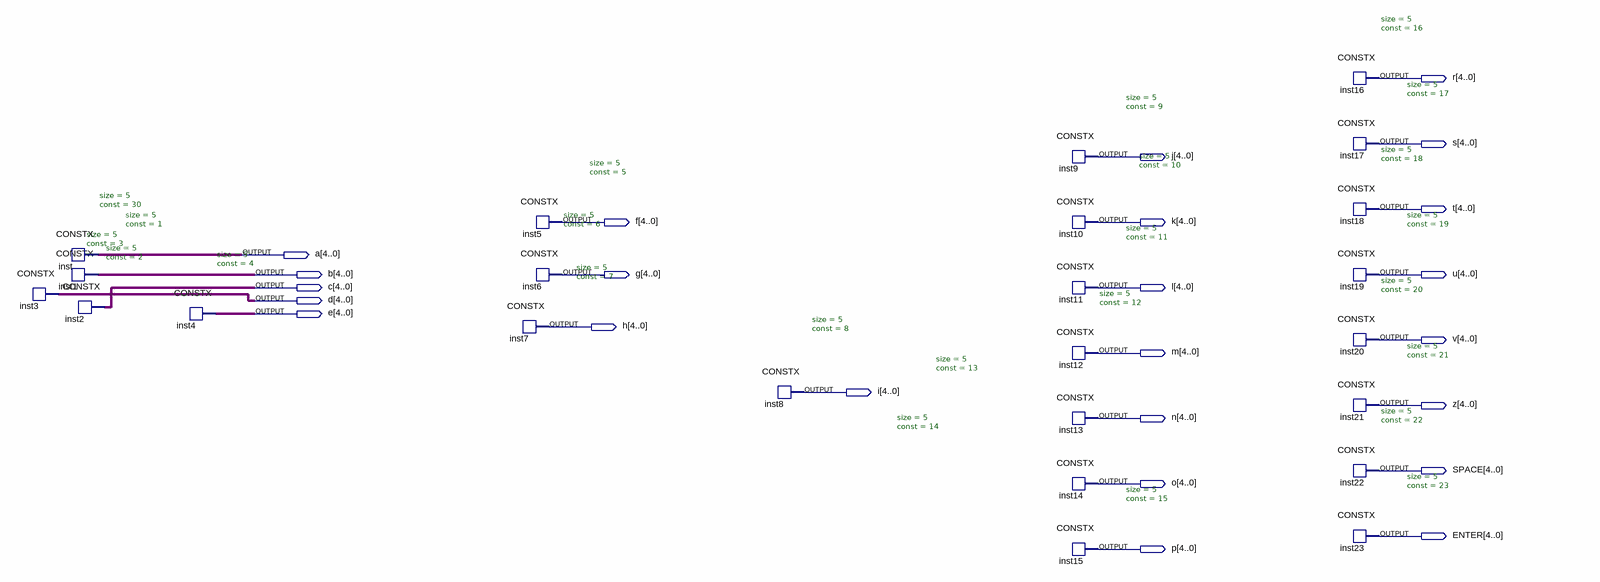
[diagram p0: schematic sheet]
// Quartus schematic lettercodes.bdf as structural Verilog: 24 symbols, 24 pins
module lettercodes (
  output [4:0] r,
  output [4:0] s,
  output [4:0] j,
  output [4:0] t,
  output [4:0] f,
  output [4:0] k,
  output [4:0] a,
  output [4:0] b,
  output [4:0] g,
  output [4:0] u,
  output [4:0] c,
  output [4:0] l,
  output [4:0] d,
  output [4:0] e,
  output [4:0] h,
  output [4:0] v,
  output [4:0] m,
  output [4:0] i,
  output [4:0] z,
  output [4:0] n,
  output [4:0] SPACE,
  output [4:0] o,
  output [4:0] ENTER,
  output [4:0] p
);

  CONSTX #(.size(5), .\const (3)) inst3 (.data(d));
  CONSTX #(.size(5), .\const (30)) inst (.data(a));
  CONSTX #(.size(5), .\const (1)) inst1 (.data(b));
  CONSTX #(.size(5), .\const (2)) inst2 (.data(c));
  CONSTX #(.size(5), .\const (4)) inst4 (.data(e));
  CONSTX #(.size(5), .\const (5)) inst5 (.data(f));
  CONSTX #(.size(5), .\const (6)) inst6 (.data(g));
  CONSTX #(.size(5), .\const (7)) inst7 (.data(h));
  CONSTX #(.size(5), .\const (8)) inst8 (.data(i));
  CONSTX #(.size(5), .\const (9)) inst9 (.data(j));
  CONSTX #(.size(5), .\const (10)) inst10 (.data(k));
  CONSTX #(.size(5), .\const (11)) inst11 (.data(l));
  CONSTX #(.size(5), .\const (12)) inst12 (.data(m));
  CONSTX #(.size(5), .\const (13)) inst13 (.data(n));
  CONSTX #(.size(5), .\const (14)) inst14 (.data(o));
  CONSTX #(.size(5), .\const (15)) inst15 (.data(p));
  CONSTX #(.size(5), .\const (16)) inst16 (.data(r));
  CONSTX #(.size(5), .\const (17)) inst17 (.data(s));
  CONSTX #(.size(5), .\const (18)) inst18 (.data(t));
  CONSTX #(.size(5), .\const (19)) inst19 (.data(u));
  CONSTX #(.size(5), .\const (20)) inst20 (.data(v));
  CONSTX #(.size(5), .\const (21)) inst21 (.data(z));
  CONSTX #(.size(5), .\const (22)) inst22 (.data(SPACE));
  CONSTX #(.size(5), .\const (23)) inst23 (.data(ENTER));
endmodule
